# Altium schematic sheet 03-8A34004_DPLL-1.SchDoc
size B; SheetNumber: 3; SheetTotal: 8
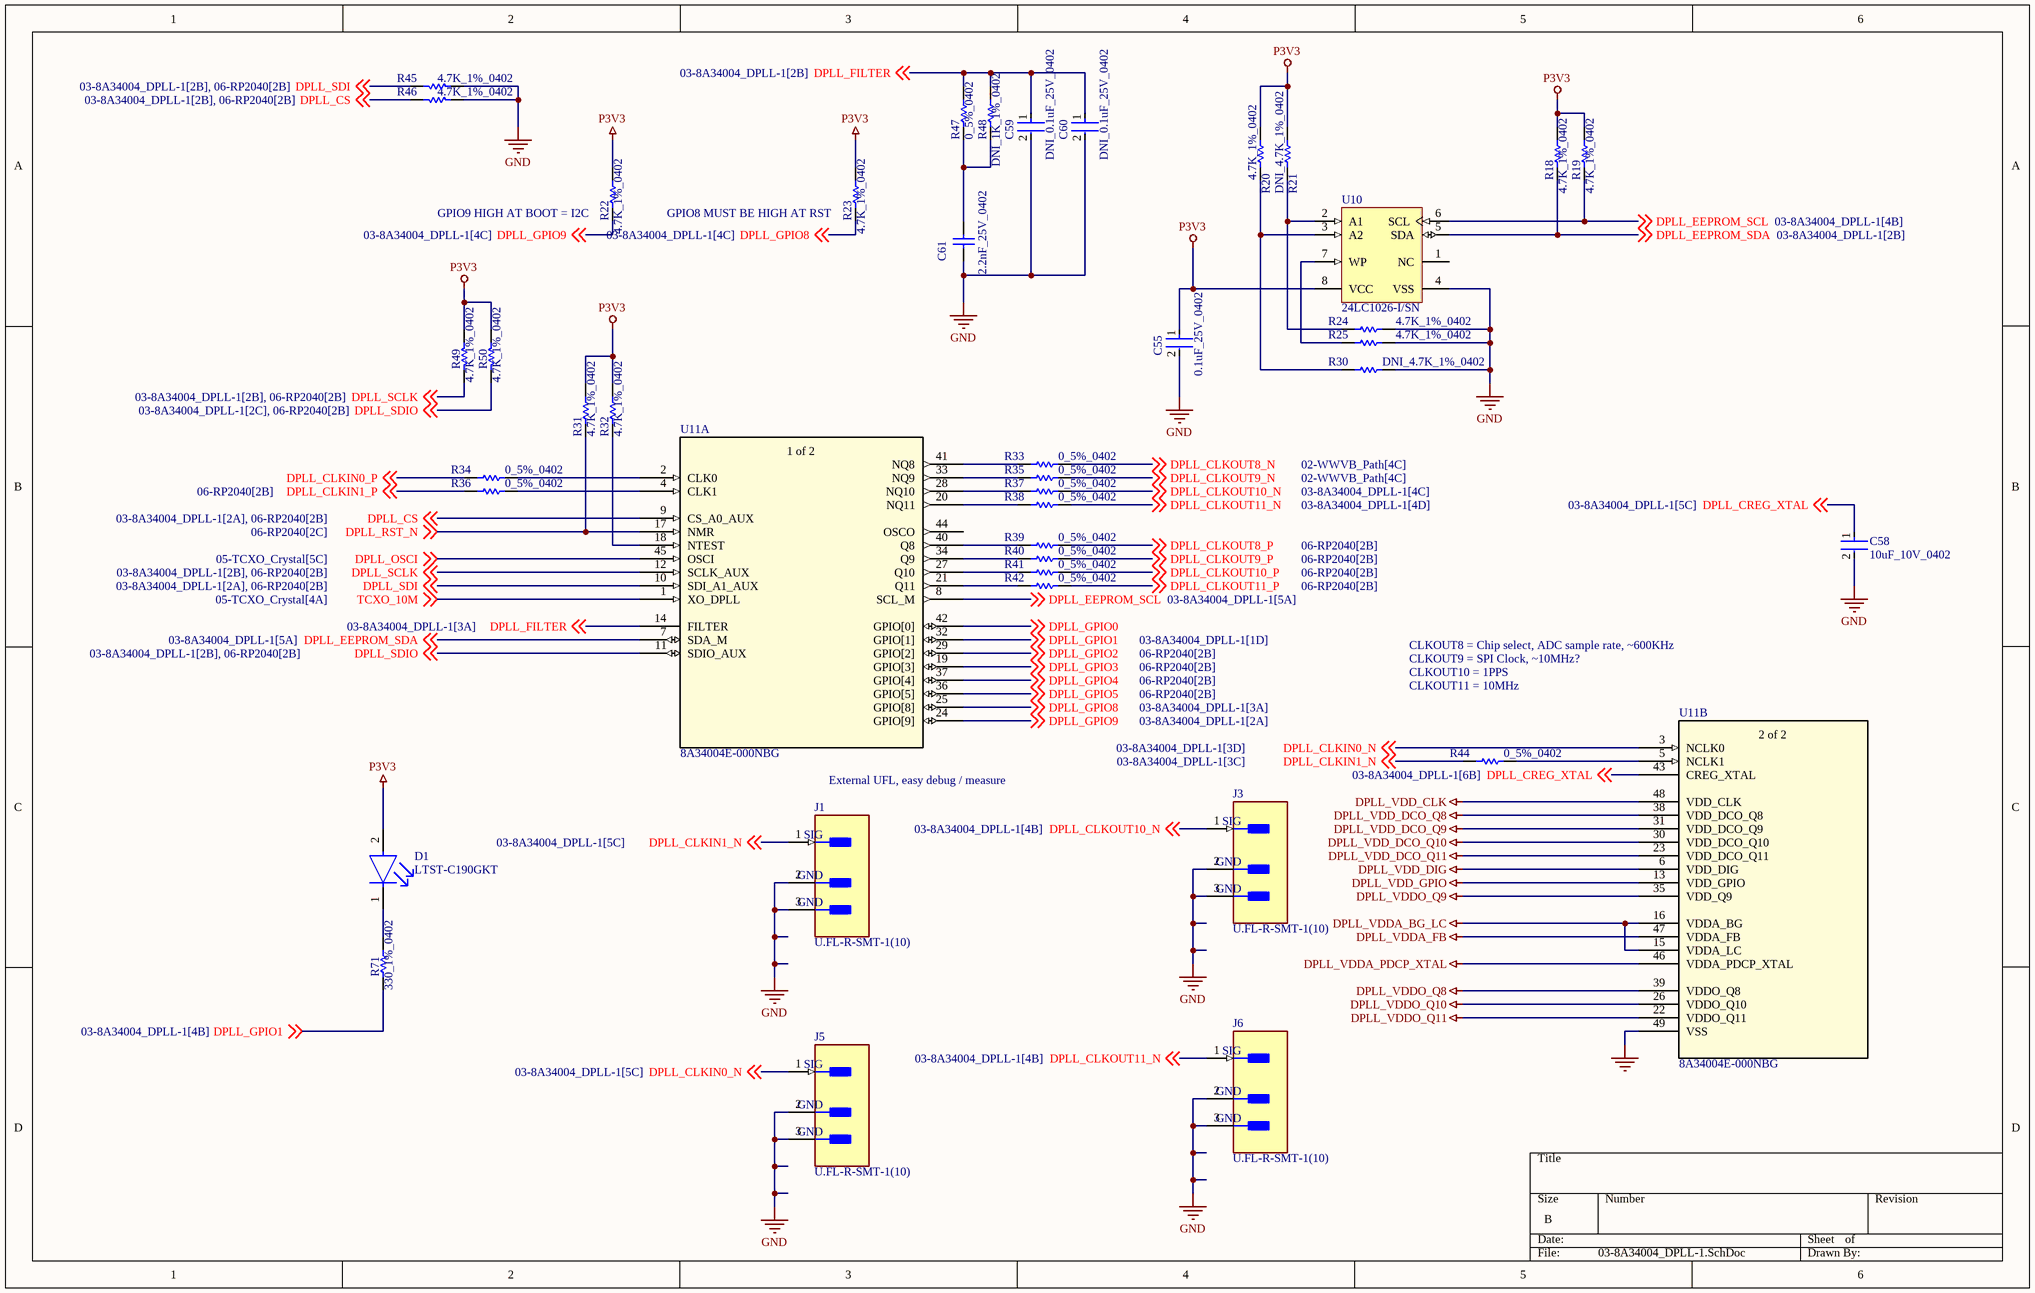
[diagram p0: 03-8A34004_DPLL-1.SchDoc]

## Parts
C55  0.1uF_25V_0402  [FP-0402-L_1_0_1-W_0_5_0_1-IPC_C]
C58  10uF_10V_0402  [FP-CL05A106MP5NUNC-MFG]
C59  DNI_0.1uF_25V_0402  [FP-0402-L_1_0_1-W_0_5_0_1-IPC_C]  (no BOM)
C60  DNI_0.1uF_25V_0402  [FP-0402-L_1_0_1-W_0_5_0_1-IPC_C]  (no BOM)
C61  2.2nF_25V_0402  [CAPC1005X56X25LL10T15]
D1  LTST-C190GKT  [FP-LTST-C190GKT-MFG]
J1  U.FL-R-SMT-1(10)  [FP-U_FL-R-SMT-1_10-MFG]
J3  U.FL-R-SMT-1(10)  [FP-U_FL-R-SMT-1_10-MFG]
J5  U.FL-R-SMT-1(10)  [FP-U_FL-R-SMT-1_10-MFG]
J6  U.FL-R-SMT-1(10)  [FP-U_FL-R-SMT-1_10-MFG]
R18  4.7K_1%_0402  [RESC1005X40X25NL10T10]
R19  4.7K_1%_0402  [RESC1005X40X25NL10T10]
R20  4.7K_1%_0402  [RESC1005X40X25NL10T10]
R21  DNI_4.7K_1%_0402  [RESC1005X40X25NL10T10]  (no BOM)
R22  4.7K_1%_0402  [RESC1005X40X25NL10T10]
R23  4.7K_1%_0402  [RESC1005X40X25NL10T10]
R24  4.7K_1%_0402  [RESC1005X40X25NL10T10]
R25  4.7K_1%_0402  [RESC1005X40X25NL10T10]
R30  DNI_4.7K_1%_0402  [RESC1005X40X25NL10T10]  (no BOM)
R31  4.7K_1%_0402  [RESC1005X40X25NL10T10]
R32  4.7K_1%_0402  [RESC1005X40X25NL10T10]
R33  0_5%_0402  [RESC1005X40X25NL05T10]
R34  0_5%_0402  [RESC1005X40X25NL05T10]
R35  0_5%_0402  [RESC1005X40X25NL05T10]
R36  0_5%_0402  [RESC1005X40X25NL05T10]
R37  0_5%_0402  [RESC1005X40X25NL05T10]
R38  0_5%_0402  [RESC1005X40X25NL05T10]
R39  0_5%_0402  [RESC1005X40X25NL05T10]
R40  0_5%_0402  [RESC1005X40X25NL05T10]
R41  0_5%_0402  [RESC1005X40X25NL05T10]
R42  0_5%_0402  [RESC1005X40X25NL05T10]
R44  0_5%_0402  [RESC1005X40X25NL05T10]
R45  4.7K_1%_0402  [RESC1005X40X25NL10T10]
R46  4.7K_1%_0402  [RESC1005X40X25NL10T10]
R47  0_5%_0402  [RESC1005X40X25LL10T10]
R48  DNI_1K_1%_0402  [RESC1005X40X25NL05T05]  (no BOM)
R49  4.7K_1%_0402  [RESC1005X40X25NL10T10]
R50  4.7K_1%_0402  [RESC1005X40X25NL10T10]
R71  330_1%_0402  [RESC1005X40X25NL10T10]
U10  24LC1026-I/SN  [MCHP-SOIC-SN8_N]
U11  8A34004E-000NBG  [NBG48P1_REN]  (parts A,B of 2)

## Nets
DPLL_VDD_CLK: U11.48(VDD_CLK)
DPLL_VDD_DCO_Q8: U11.38(VDD_DCO_Q8)
DPLL_VDD_DCO_Q9: U11.31(VDD_DCO_Q9)
DPLL_VDD_DCO_Q10: U11.30(VDD_DCO_Q10)
DPLL_VDD_DCO_Q11: U11.23(VDD_DCO_Q11)
DPLL_VDD_DIG: U11.6(VDD_DIG)
DPLL_VDD_GPIO: U11.13(VDD_GPIO)
DPLL_VDDA_BG_LC: U11.15(VDDA_LC) U11.16(VDDA_BG)
DPLL_VDDA_FB: U11.47(VDDA_FB)
DPLL_VDDA_PDCP_XTAL: U11.46(VDDA_PDCP_XTAL)
DPLL_VDDO_Q8: U11.39(VDDO_Q8)
DPLL_VDDO_Q9: U11.35(VDD_Q9)
DPLL_VDDO_Q10: U11.26(VDDO_Q10)
DPLL_VDDO_Q11: U11.22(VDDO_Q11)
GND: C55.2 C58.2 C59.2 C60.2 C61.1 J1.2(GND) J1.3(GND) J3.2(GND) J3.3(GND) J5.2(GND) J5.3(GND) J6.2(GND) J6.3(GND) R24.1 R25.1 R30.2 R45.2 R46.2 U10.4(VSS) U11.49(VSS)
P3V3: C55.1 D1.2(A) R18.1 R19.1 R20.2 R21.2 R22.1 R23.1 R31.2 R32.2 R49.2 R50.2 U10.8(VCC)
DPLL_CLKIN0_N: J5.1(SIG) U11.3(NCLK0) ; off-sheet DPLL_CLKIN0_N
DPLL_CLKIN0_P: R34.1 ; off-sheet DPLL_CLKIN0_P
DPLL_CLKIN1_N: J1.1(SIG) R44.1 ; off-sheet DPLL_CLKIN1_N
DPLL_CLKIN1_P: R36.1 ; off-sheet DPLL_CLKIN1_P
DPLL_CLKOUT8_N: R33.2 ; off-sheet DPLL_CLKOUT8_N
DPLL_CLKOUT8_P: R39.2 ; off-sheet DPLL_CLKOUT8_P
DPLL_CLKOUT9_N: R35.2 ; off-sheet DPLL_CLKOUT9_N
DPLL_CLKOUT9_P: R40.2 ; off-sheet DPLL_CLKOUT9_P
DPLL_CLKOUT10_N: J3.1(SIG) R37.2 ; off-sheet DPLL_CLKOUT10_N
DPLL_CLKOUT10_P: R41.2 ; off-sheet DPLL_CLKOUT10_P
DPLL_CLKOUT11_N: J6.1(SIG) R38.2 ; off-sheet DPLL_CLKOUT11_N
DPLL_CLKOUT11_P: R42.2 ; off-sheet DPLL_CLKOUT11_P
DPLL_CREG_XTAL: C58.1 U11.43(CREG_XTAL) ; off-sheet DPLL_CREG_XTAL
DPLL_CS: R46.1 U11.9(CS_A0_AUX) ; off-sheet DPLL_CS
DPLL_EEPROM_SCL: R19.2 U10.6(SCL) U11.8(SCL_M) ; off-sheet DPLL_EEPROM_SCL
DPLL_EEPROM_SDA: R18.2 U10.5(SDA) U11.7(SDA_M) ; off-sheet DPLL_EEPROM_SDA
DPLL_FILTER: C59.1 C60.1 R47.2 R48.2 U11.14(FILTER) ; off-sheet DPLL_FILTER
DPLL_GPIO0: U11.42(GPIO[0]) ; off-sheet DPLL_GPIO0
DPLL_GPIO1: R71.1 U11.32(GPIO[1]) ; off-sheet DPLL_GPIO1
DPLL_GPIO2: U11.29(GPIO[2]) ; off-sheet DPLL_GPIO2
DPLL_GPIO3: U11.19(GPIO[3]) ; off-sheet DPLL_GPIO3
DPLL_GPIO4: U11.37(GPIO[4]) ; off-sheet DPLL_GPIO4
DPLL_GPIO5: U11.36(GPIO[5]) ; off-sheet DPLL_GPIO5
DPLL_GPIO8: R23.2 U11.25(GPIO[8]) ; off-sheet DPLL_GPIO8
DPLL_GPIO9: R22.2 U11.24(GPIO[9]) ; off-sheet DPLL_GPIO9
DPLL_OSCI: U11.45(OSCI) ; off-sheet DPLL_OSCI
DPLL_RST_N: R31.1 U11.17(NMR) ; off-sheet DPLL_RST_N
DPLL_SCLK: R49.1 U11.12(SCLK_AUX) ; off-sheet DPLL_SCLK
DPLL_SDI: R45.1 U11.10(SDI_A1_AUX) ; off-sheet DPLL_SDI
DPLL_SDIO: R50.1 U11.11(SDIO_AUX) ; off-sheet DPLL_SDIO
TCXO_10M: U11.1(XO_DPLL) ; off-sheet TCXO_10M
NetC61_2: C61.2 R47.1 R48.1
NetD1_1: D1.1(C) R71.2
NetR20_1: R20.1 R30.1 U10.3(A2)
NetR21_1: R21.1 R24.2 U10.2(A1)
NetR25_2: R25.2 U10.7(WP)
NetR32_1: R32.1 U11.18(NTEST)
NetR33_1: R33.1 U11.41(NQ8)
NetR34_2: R34.2 U11.2(CLK0)
NetR35_1: R35.1 U11.33(NQ9)
NetR36_2: R36.2 U11.4(CLK1)
NetR37_1: R37.1 U11.28(NQ10)
NetR38_1: R38.1 U11.20(NQ11)
NetR39_1: R39.1 U11.40(Q8)
NetR40_1: R40.1 U11.34(Q9)
NetR41_1: R41.1 U11.27(Q10)
NetR42_1: R42.1 U11.21(Q11)
NetR44_2: R44.2 U11.5(NCLK1)

Not connected (* = marked no-connect by the designer): U10 1(NC); U11 44(OSCO)

## Notes on the sheet
- (near R22) GPIO9 HIGH AT BOOT = I2C
- GPIO8 MUST BE HIGH AT RST
- CLKOUT8 = Chip select, ADC sample rate, ~600KHz
- CLKOUT9 = SPI Clock, ~10MHz?
- CLKOUT10 = 1PPS
- CLKOUT11 = 10MHz
- External UFL, easy debug / measure
- (in symbol 8A34004E-000NBG, part A) 1 of 2
- (in symbol 8A34004E-000NBG, part B) 2 of 2

## Library data of the parts
C55 C59 C60 = CMP-2008-02519-2: General Purpose Ceramic Capacitor, 0402, 100nF, 10%, X7R, 15%, 25V; Package Quantity: 1; Capacitance: 100nF; Min Operating Temperature: -55°C; Voltage: 25V; Voltage Rating: 25V; Construction: Flat; Max Operating Temperature: 125°C; Radiation Hardening: No; Depth: 0.5mm; Thickness: 0.022inch; Voltage Rating (DC): 25V; Number of Pins: 2; Lead Free: Lead Free; Series: -; REACH SVHC: No SVHC; Length: 1mm; Dielectric: X7R; RoHS Compliant: Yes; Mount: Surface Mount; Packaging: Tape and Reel; Case/Package: 0402; Case Code (Imperial): 0402; Termination: SMD/SMT; Width: 0.02inch; Case Code (Metric): 1005; Tolerance: 10%
C58 = CMP-13271-000002-1: CAP CER 10UF 10V X5R 0402; Manufacturer Part Number: CL05A106MP5NUNC; Manufacturer: Samsung; Temperature Coefficient: 15%; Tolerance: 20%; Material: Ceramic; Octopart: https://octopart.com/cl05a106mp5nunc-samsung-22457395; Voltage Rating: 10V; RoHS: TRUE; Value: 10uF; Height: 0.7mm; Digikey Description: CAP CER 10UF 10V X5R 0402; Automotive: No; Package: CL05A106MP5NUNC; Device Class L1: Passive Components; Capacitance: 10uF; Temperature Range High: +85°C; ComponentLink2Description: Datasheet; Device Class L2: Capacitors; Temperature Characteristic: X5R; Temperature: -55°C to +85°C; ComponentLink2URL: http://www.samsungsem.com/kr/support/product-search/mlcc/__icsFiles/afieldfile/2019/05/10/19-CL05A106MP5NUNC.pdf; Device Class L3: Ceramic Capacitors; Category: Cap; Temperature Range Low: -55°C; Ipc Land Pattern Name: CAPC10050X50; Lead Free: Yes
C61 = CMP-2008-02907-1: Manufacturer: AVX Interconnect / Elco; Part Number: 04025C222JAT2A
D1 = CMP-22017-000005-2: LED GREEN CLEAR CHIP SMD; Dominant Wavelength: 569nm; Reverse Voltage: 5V; Lens Color: Colorless; Viewing Angle: 130°; Voltage: 2V; Forward Current: 30mA; Power Dissipation: 100mW; Luminous Intensity: 6mcd; Number of LEDs: 1; Forward Voltage: 2.1V; Wavelength: 565nm; Test Current: 10mA; Min Operating Temperature: -55°C; Lens Style: Clear; Mount: Surface Mount; Width: 0.8mm; Packaging: Tape and Reel; Lens Transparency: Clear; Case Code (Metric): 1608; Depth: 0.8mm; Case Code (Imperial): 0603; Case/Package: 0603; Number of Pins: 2; Max Operating Temperature: 85°C; Lead Free: Lead Free; Number of Elements: 1; Length: 1.6mm; Height: 0.8mm; Package Quantity: 1; Power Rating: 100mW; Radiation Hardening: No; Illumination Color: Green; Color: Green
J1 J3 J5 J6 = CMP-2000-05152-3: CONN U.FL RCPT STR 50 OHM SMD; Max Frequency: 6GHz; Connector Type: Coaxial; Body Plating: Silver; Body Material: Bronze; Impedance: 50R; Dielectric Material: Polymer; Insulation Resistance: 500MR; Gender: Male; Packaging: Cut Tape; Length: 3mm; Package Quantity: 2500; Termination: Solder; Lead Free: Lead Free; Series: U.FL; Min Operating Temperature: -40°C; Fastening Type: Snap; Contact Material: Brass; Orientation: Straight; Wire/Cable Type: Coaxial; Frequency: 6GHz; Contact Plating: Gold; Depth: 3.1mm; Weight: 0.001764oz; Max Operating Temperature: 90°C; Radiation Hardening: No; REACH SVHC: No SVHC; Mount: Surface Mount; Housing Color: Beige
R18-R25 R30-R32 R45 R46 R49 R50 = CMP-2002-05217-1: Manufacturer: Bourns; Part Number: CR0402-FX-4701GLF
R33-R42 R44 = CMP-2002-06457-1: Manufacturer: Panasonic; Part Number: ERJ-U020R00X
R47 = CMP-2002-04569-1: Manufacturer: KOA Speer; Part Number: RK73Z1ETTP
R48 = CMP-2002-08277-1: Manufacturer: Vishay Dale; Part Number: CRCW04021K00FKTD
R71 = CMP-2002-05853-1: Manufacturer: Panasonic; Part Number: ERA-2AED331X
U10 = CMP-0159-01024-1: 1024K bits I2C™ Serial EEPROM, 2.5 to 5.5 V, 400 kHz, -40 to 85 degC, 8-pin SOIC (SN8), Tube; Manufacturer: Microchip; DatasheetVersion: Rev. C; ComponentLink3Description: Package Specification; ComponentLink1URL: http://www.microchip.com; Mounting Technology: Surface Mount; ComponentLink4URL: http://www.microchip.com/24LC1026; ComponentLink2Description: Datasheet; PartNumber: 24LC1026-I/SN; PackageReference: SOIC-SN8; PackageDescription: 8-Lead Plastic Small Outline, 4.9 x 3.9 mm Body, 1.27 mm Pitch; ComponentLink1Description: Manufacturer URL; ComponentLink3URL: http://www.microchip.com/stellent/groups/techpub_sg/documents/packagingspec/en012702.pdf; ComponentLink2URL: http://ww1.microchip.com/downloads/en/DeviceDoc/22270C.pdf; PackageVersion: C04-057C; ComponentLink4Description: Product URL
U11 = 8A34004E-000NBG: No Description Available; Mfr_Name: Renesas Electronics; RefDes: RefDes; Type: Type